# Altium schematic sheet Sheet1.SchDoc
size A4
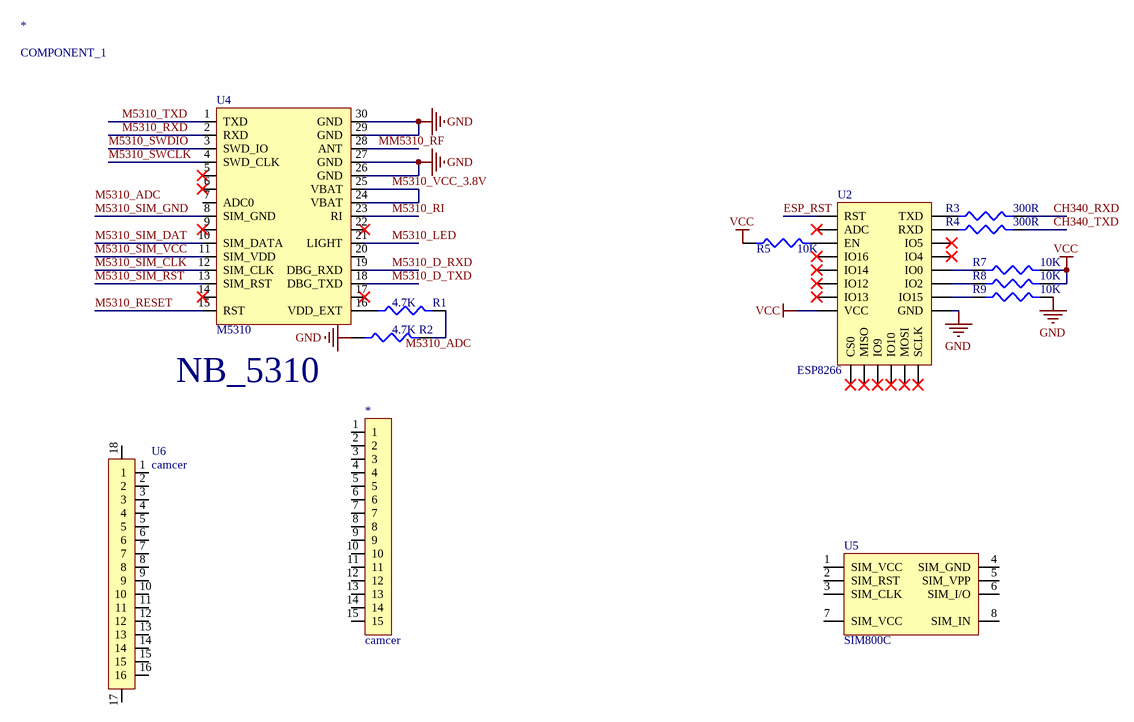
[diagram p0: Sheet1.SchDoc]

## Parts
(Parts that share a designator on the sheet are numbered #1, #2 ... from top to bottom, then left to right.)
*#1  COMPONENT_1
*#2  camcer
R1  4.7K
R2  4.7K
R3  300R
R4  300R
R5  10K
R7  10K
R8  10K
R9  10K
U2  ESP8266
U4  M5310
U5  SIM800C
U6  camcer

## Nets
GND: R2.1 R9.2 U2.55(GND) U4.26(GND) U4.27(GND) U4.29(GND) U4.30(GND)
VCC: R5.1 R7.2 R8.2 U2.41(VCC)
CH340_RXD: R3.2
CH340_TXD: R4.2
ESP_RST: U2.34(RST)
M5310_D_RXD: U4.19(DBG_RXD)
M5310_D_TXD: U4.18(DBG_TXD)
M5310_LED: U4.21(LIGHT)
M5310_RESET: U4.15(RST)
M5310_RI: U4.23(RI)
M5310_RXD: U4.2(RXD)
M5310_SIM_CLK: U4.12(SIM_CLK)
M5310_SIM_DAT: U4.10(SIM_DATA)
M5310_SIM_GND: U4.8(SIM_GND)
M5310_SIM_RST: U4.13(SIM_RST)
M5310_SIM_VCC: U4.11(SIM_VDD)
M5310_SWCLK: U4.4(SWD_CLK)
M5310_SWDIO: U4.3(SWD_IO)
M5310_TXD: U4.1(TXD)
M5310_VCC_3.8V: U4.24(VBAT) U4.25(VBAT)
MM5310_RF: U4.28(ANT)
NetR1_1: R1.1 U4.16(VDD_EXT)
NetR1_2: R1.2 R2.2
NetR7_1: R7.1 U2.52(IO0)
NetR8_1: R8.1 U2.53(IO2)
NetR9_1: R9.1 U2.54(IO15)

Not connected (* = marked no-connect by the designer): *#2 1 2 3 4 5 6 7 8 9 10 11 12 13 14 15; R3 1; R4 1; R5 2; U2 35(ADC)* 36(EN) 37(IO16)* 38(IO14)* 39(IO12)* 40(IO13)* 42(CS0)* 43(MISO)* 44(IO9)* 45(IO10)* 46(MOSI)* 47(SCLK)* 48(TXD) 49(RXD) 50(IO5)* 51(IO4)*; U4 5(41)* 6(42)* 7(ADC0) 9(45)* 14* 17* 20 22*; U5 1(SIM_VCC) 2(SIM_RST) 3(SIM_CLK) 4(SIM_GND) 5(SIM_VPP) 6(SIM_I/O) 7(SIM_VCC) 8(SIM_IN); U6 1 2 3 4 5 6 7 8 9 10 11 12 13 14 15 16 17(19) 18

## Notes on the sheet
- NB_5310
- Labels drawn without touching a wire or pin: M5310_ADC

## Library data of the parts
R1-R5 R7-R9 = 电位器2
U4 = NB
U5 = SIM